# Altium schematic sheet SH2 - 17V BUCK CONVERTER.SchDoc: 17V Buck Converter
size B; CheckedBy: Cindy Li; Engineer: Farris Matar; Organization: UW Robotics; Address1: 200 University Avenue; Address2: Waterloo; Address3: Ontario; Address4: Canada N2L 3G6; DocumentNumber: 2; Revision: 3; SheetNumber: 2; SheetTotal: 9
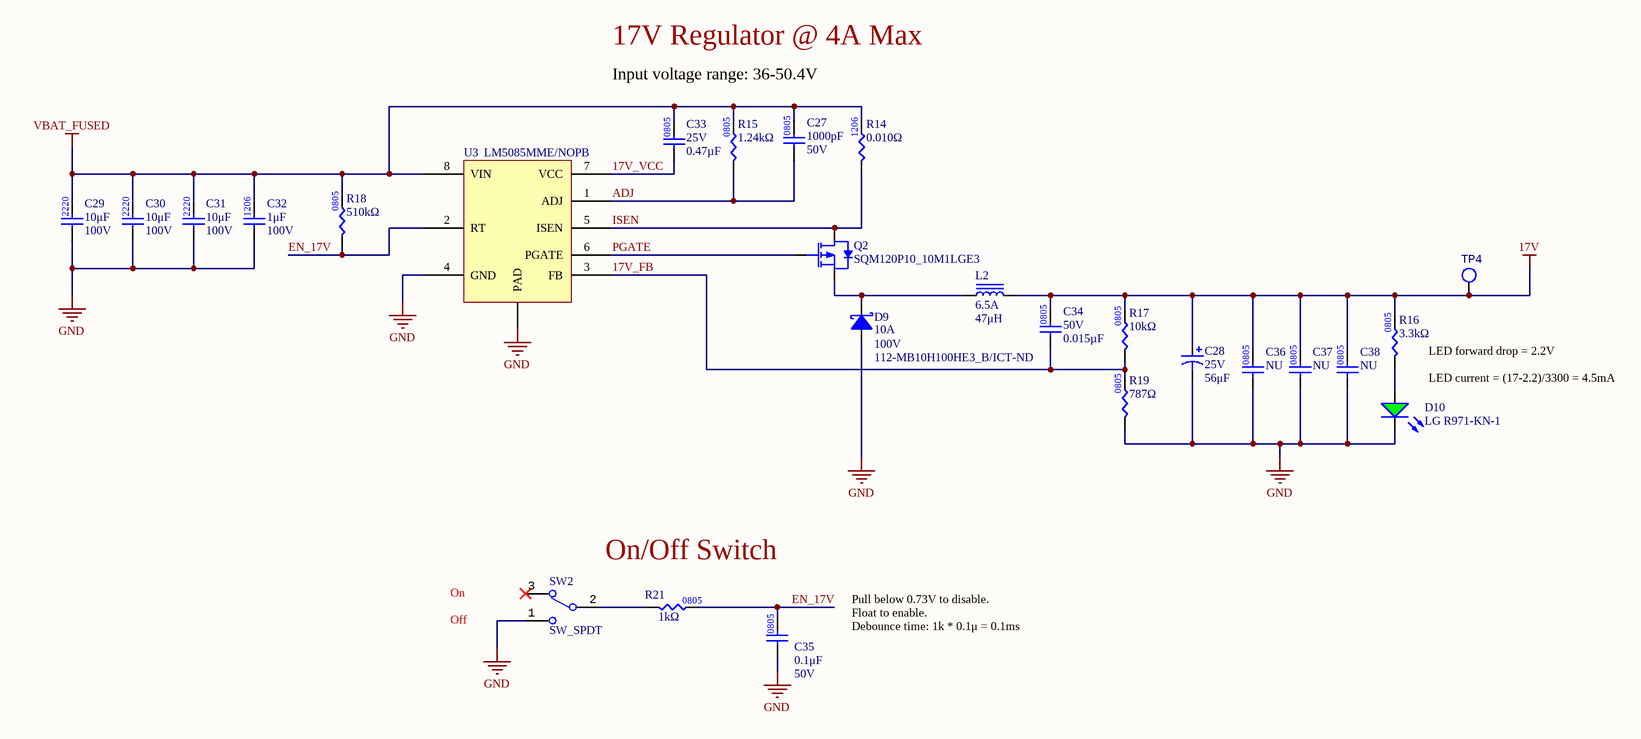
[diagram p0: SH2 - 17V BUCK CONVERTER.SchDoc]

## Parts
C27  value 1000pF  Voltage Rating: 50V  [CAP2012]  (hidden comment: CAP_1000pF_50V_0805)
C28  value 56μF  Voltage Rating: 25V  [RADIAL_PANASONIC_D]  (hidden comment: CAP_56uF_25V_ALUM)
C29  value 10μF  Voltage Rating: 100V  [CAP2220]  (hidden comment: CAP_10μF_100V_2220)
C30  value 10μF  Voltage Rating: 100V  [CAP2220]  (hidden comment: CAP_10μF_100V_2220)
C31  value 10μF  Voltage Rating: 100V  [CAP2220]  (hidden comment: CAP_10μF_100V_2220)
C32  value 1μF  Voltage Rating: 100V  [CAPC3216X190X50NL20T25]  (hidden comment: CAP_1uF_100V_1206)
C33  value 0.47µF  Voltage Rating: 25V  [CAP0805]  (hidden comment: CAP_0.47uF_25V_0805)
C34  value 0.015µF  Voltage Rating: 50V  [CAP0805]  (hidden comment: CAP_0.015uF_50V_0805)
C35  value 0.1μF  Voltage Rating: 50V  [CAP2012]  (hidden comment: CAP_0.1uF_50V_0805)
C36  value NU  [CAP0805]  (hidden comment: CAP_NU_0805)
C37  value NU  [CAP0805]  (hidden comment: CAP_NU_0805)
C38  value NU  [CAP0805]  (hidden comment: CAP_NU_0805)
D9  Vr (Max): 100V  Supplier Part Number 1: 112-MB10H100HE3_B/ICT-ND  Forward Current: 10A  [D-PAK3]  (hidden comment: DIO_SCHOTTKY_100V_5.5A)
D10  Manufacturer Part Number 1: LG R971-KN-1  [LED_0805_GREEN]  (hidden comment: LED_GREEN)
L2  Current Rating: 6.5A  Inductance: 47μH  [IND_BOURNS_SRP1265]  (hidden comment: IND_47uH_6.5A)
Q2  Manufacturer Part Number 1: SQM120P10_10M1LGE3  [D-PAK]  (hidden comment: PMOS_100V_120A)
R14  value 0.010Ω  [RES1206]  (hidden comment: RES_0.010Ω_1206_1%)
R15  value 1.24kΩ  [RES0805]  (hidden comment: RES_1.24kΩ_0805_1%)
R16  value 3.3kΩ  [RES0805]  (hidden comment: RES_3.3kΩ_0805_1%)
R17  value 10kΩ  [RES0805]  (hidden comment: RES_10kΩ_0805_5%)
R18  value 510kΩ  [RES0805]  (hidden comment: RES_510kΩ_0805_1%)
R19  value 787Ω  [RES0805]  (hidden comment: RES_787Ω_0805_1%)
R21  value 1kΩ  [RES0805]  (hidden comment: RES_1kΩ_0805_1%_1)
SW2  SW_SPDT  [100SP1T1B4M2QE]
TP4  TESTPOINT_LOOP  [TESTPOINT_LOOP]  (value not drawn)
U3  Manufacturer Part Number 1: LM5085MME/NOPB  [8-VSSOP]  (hidden comment: BUCK_LMR14050SDDAR)

## Nets
17V: C28.1 C34.2 C36.2 C37.2 C38.2 L2.2 R16.2 R17.2 TP4.1
GND: C28.2 C29.1 C30.1 C31.1 C32.1 C35.1 C36.1 C37.1 C38.1 D9.1(Anode) D10.2(K) R19.1 SW2.1 U3.4(GND) U3.9(PAD)
VBAT_FUSED: C27.2 C29.2 C30.2 C31.2 C32.2 C33.2 R14.2 R15.2 R18.2 U3.8(VIN)
17V_FB: C34.1 R17.1 R19.2 U3.3(FB)
17V_VCC: C33.1 U3.7(VCC)
ADJ: C27.1 R15.1 U3.1(ADJ)
EN_17V: C35.2 R18.1 R21.2 U3.2(RT)
ISEN: Q2.1(Drain) R14.1 U3.5(ISEN)
PGATE: Q2.2(Gate) U3.6(PGATE)
NetD9_2: D9.2(Cathode) L2.1 Q2.3(Source)
NetD10_1: D10.1(A) R16.1
NetR21_1: R21.1 SW2.2

Not connected (* = marked no-connect by the designer): SW2 3*

## Notes on the sheet
- Input voltage range: 36-50.4V
- 17V Regulator @ 4A Max
- LED forward drop = 2.2V
  LED current = (17-2.2)/3300 = 4.5mA
- Off
- On
- On/Off Switch
- Pull below 0.73V to disable.
  Float to enable.
  Debounce time: 1k * 0.1μ = 0.1ms
- Title:
- Project:
- Date:
- Rev:
- Reviewer:
- Engineer:
- Sheet:
- of

## Library data of the parts
C27 = CAP_1000pF_50V_0805: CAP CER 1000pF 50V X7R 0805; Manufacturer 1: Samsung; Manufacturer Part Number 1: CL21B102KBANNNC; Package/Footprint: 0805; Supplier 1: Digi-Key; Mounting Type: SMD; Supplier Part Number 1: 1276-1020-1-ND; Dielectric: X7R
C28 = CAP_56uF_25V_ALUM: CAP ALUM POLY HYB 56UF 25V SMD; Manufacturer Part Number 1: EEH-ZC1E560P; Manufacturer 1: Panasonic Electronic Components; Supplier 1: Digi-Key; Supplier Part Number 1: P15460CT-ND
C29-C31 = CAP_10μF_100V_2220: CAP CER 10UF 100V X7S 2220; Manufacturer 1: TDK Corporation; Manufacturer Part Number 1: CGA9N3X7S2A106K230KE; Mounting Type: SMD; Package: 2220; Supplier 1: Digi-Key; Supplier Part Number 1: 445-8768-1-ND
C32 = CAP_1uF_100V_1206: CAP CER 1UF 100V X7R 1206; Supplier 1: Digi-Key; Mounting Type: SMD; Package: 1206; Supplier Part Number 1: 490-16468-1-ND
C33 = CAP_0.47uF_25V_0805: CAP CER 0.47UF 25V X5R 0805; Manufacturer 1: KEMET; Manufacturer Part Number 1: C0805C474K3PAC7800; Package: 0805; Supplier 1: Digi-Key; Supplier Part Number 1: 399-15508-1-ND
C34 = CAP_0.015uF_50V_0805: CAP CER 0.015UF 50V C0G 0805; Manufacturer 1: TDK Corporation; Manufacturer Part Number 1: CGA4F2C0G1H153J085AA; Package: 0805; Supplier 1: Digi-Key; Supplier Part Number 1: 445-6948-1-ND
C35 = CAP_0.1uF_50V_0805: CAP CER 0.1UF 50V X7R 0805; Manufacturer Part Number 1: GCM21BR71H104KA37K; Manufacturer 1: Murata Electronics; Package/Footprint: 0805; Supplier Part Number 1: 490-8049-1-ND; Supplier 1: Digi-Key; Dielectric: X7R; LCSC Part #: C49678; Mounting Type: SMD
C36-C38 = CAP_NU_0805: PLACEHOLDER CAPACITOR; Mounting Type: SMD; Package: 0805
D9 = DIO_SCHOTTKY_100V_10A: DIODE SCHOTTKY 100V 10A TO263AB; Manufacturer 1: Vishay General Semiconductor - Diodes Division; Manufacturer Part Number 1: MB10H100HE3_B/I; Package/Footprint: TO-263AB; Mounting Type: SMD; Supplier 1: Digi-Key
D10 = LED_GREEN: LED GREEN DIFFUSED 0805 SMD; Manufacturer 1: OSRAM; Forward Voltage Drop: 2.2V; Package/Footprint: 0805; Supplier Part Number 1: 475-1410-1-ND; Supplier 1: Digi-Key; Mounting Type: SMD
L2 = IND_47uH_6.5A: FIXED IND 47UH 6.5A 90 MOHM SMD; Manufacturer 1: Bourns Inc.; Manufacturer Part Number 1: SRP1265A-470M; DC Resistance (DCR): 90mR; Saturation Current: 9A; Supplier 1: Digi-Key; Supplier Part Number 1: SRP1265A-470MCT-ND
Q2 = PMOS_100V_120A: MOSFET P-CH 100V 120A TO263; Manufacturer 1: Vishay Siliconix; Package/Footprint: TO-263; Vgs (Max): ±15V; Mounting Type: SMD; Verified: No; Id: 120A; Vdss: 100V; Supplier 1: Digi-Key; Supplier Part Number 1: IXTA96P085T-ND
R14 = RES_0.010Ω_1206_1%: RES 0.01 OHM 1% 1/2W 1206; Manufacturer 1: Stackpole Electronics Inc; Manufacturer Part Number 1: CSR1206FT10L0; Package/Footprint: 1206; Mounting Type: SMD; Supplier 1: Digi-Key; Supplier Part Number 1: CSR1206FT10L0CT-ND
R15 = RES_1.24kΩ_0805_1%: RES 1.24K OHM 1% 1/8W 0805; Manufacturer 1: Stackpole Electronics Inc; Manufacturer Part Number 1: RMCF0805FT1K24; Package/Footprint: 0805; Mounting Type: SMD; Supplier 1: Digi-Key; Supplier Part Number 1: RMCF0805FT1K24CT-ND
R16 = RES_3.3kΩ_0805_1%: RES 3.3K OHM 1% 1/8W 0805; Manufacturer 1: Vishay Dale; Manufacturer Part Number 1: CRCW06033K30FKEA; Mounting Type: SMD; Supplier 1: Digi-Key; Supplier Part Number 1: 541-3.30KHCT-ND; LCSC Part #: C26010; Package: 0805
R17 = RES_10kΩ_0805_5%: RES 10K OHM 5% 1/8W 0805; Manufacturer 1: Panasonic Electronic Components; Manufacturer Part Number 1: ERJ-6GEYJ103V; Package/Footprint: 0805; Supplier 1: Digi-Key; Supplier Part Number 1: P10KACT-ND; LCSC Part #: C17414; Mounting Type: SMD
R18 = RES_510kΩ_0805_1%: RES 510K OHM 5% 1/8W 0805; Manufacturer 1: Stackpole Electronics Inc; Manufacturer Part Number 1: RMCF0805JT510K; Package/Footprint: 0805; Mounting Type: SMD; Supplier 1: Digi-Key; Supplier Part Number 1: RMCF0805JT510KCT-ND
R19 = RES_787Ω_0805_1%: RES 787 OHM 1% 1/8W 0805; Manufacturer 1: Yageo; Manufacturer Part Number 1: RC0805FR-07787RL; Package/Footprint: 0805; Mounting Type: SMD; Supplier 1: Digi-Key; Supplier Part Number 1: RHM.005APCT-ND
R21 = RES_1kΩ_0805_1%_1: RES 1K OHM 1% 1/8W 0805; Manufacturer 1: Yageo; Manufacturer Part Number 1: RC0805FR-071KL; Supplier Part Number 1: 311-1.00KCRCT-ND; Supplier 1: Digi-Key; LCSC Part #: C17513; Mounting Type: SMD; Package: 0805
SW2 = SW_SPDT: SWITCH TOGGLE SPDT 5A 120V; Manufacturer 1: E-Switch; Voltage Rating (DC): 28V; Package/Footprint: TH; Supplier 1: Digi-Key; Manufacturer Part Number 1: 100SP1T1B4M2QE; Throw Configuration: SPDT; Supplier Part Number 1: EG2355-ND; Current Rating: 5A; Mounting Type: TH
TP4 = TESTPOINT_LOOP: TESTPOINT THRUHOLE; Manufacturer 1: Keystone Electronics; Manufacturer Part Number 1: 5002; Package/Footprint: TH; Supplier Part Number 1: 36-5002-ND; Supplier 1: Digi-Key; Mounting Type: TH
U3 = BUCK_LM5085: IC REG CTRLR BUCK 8VSSOP; Manufacturer 1: Texas Instruments; Output Type: Transistor Driver; Output Configuration: Positive; Package/Footprint: 8-VSSON; Mounting Type: SMD; Supplier 1: Digi-Key; Supplier Part Number 1: LM5085MME/NOPBCT-ND